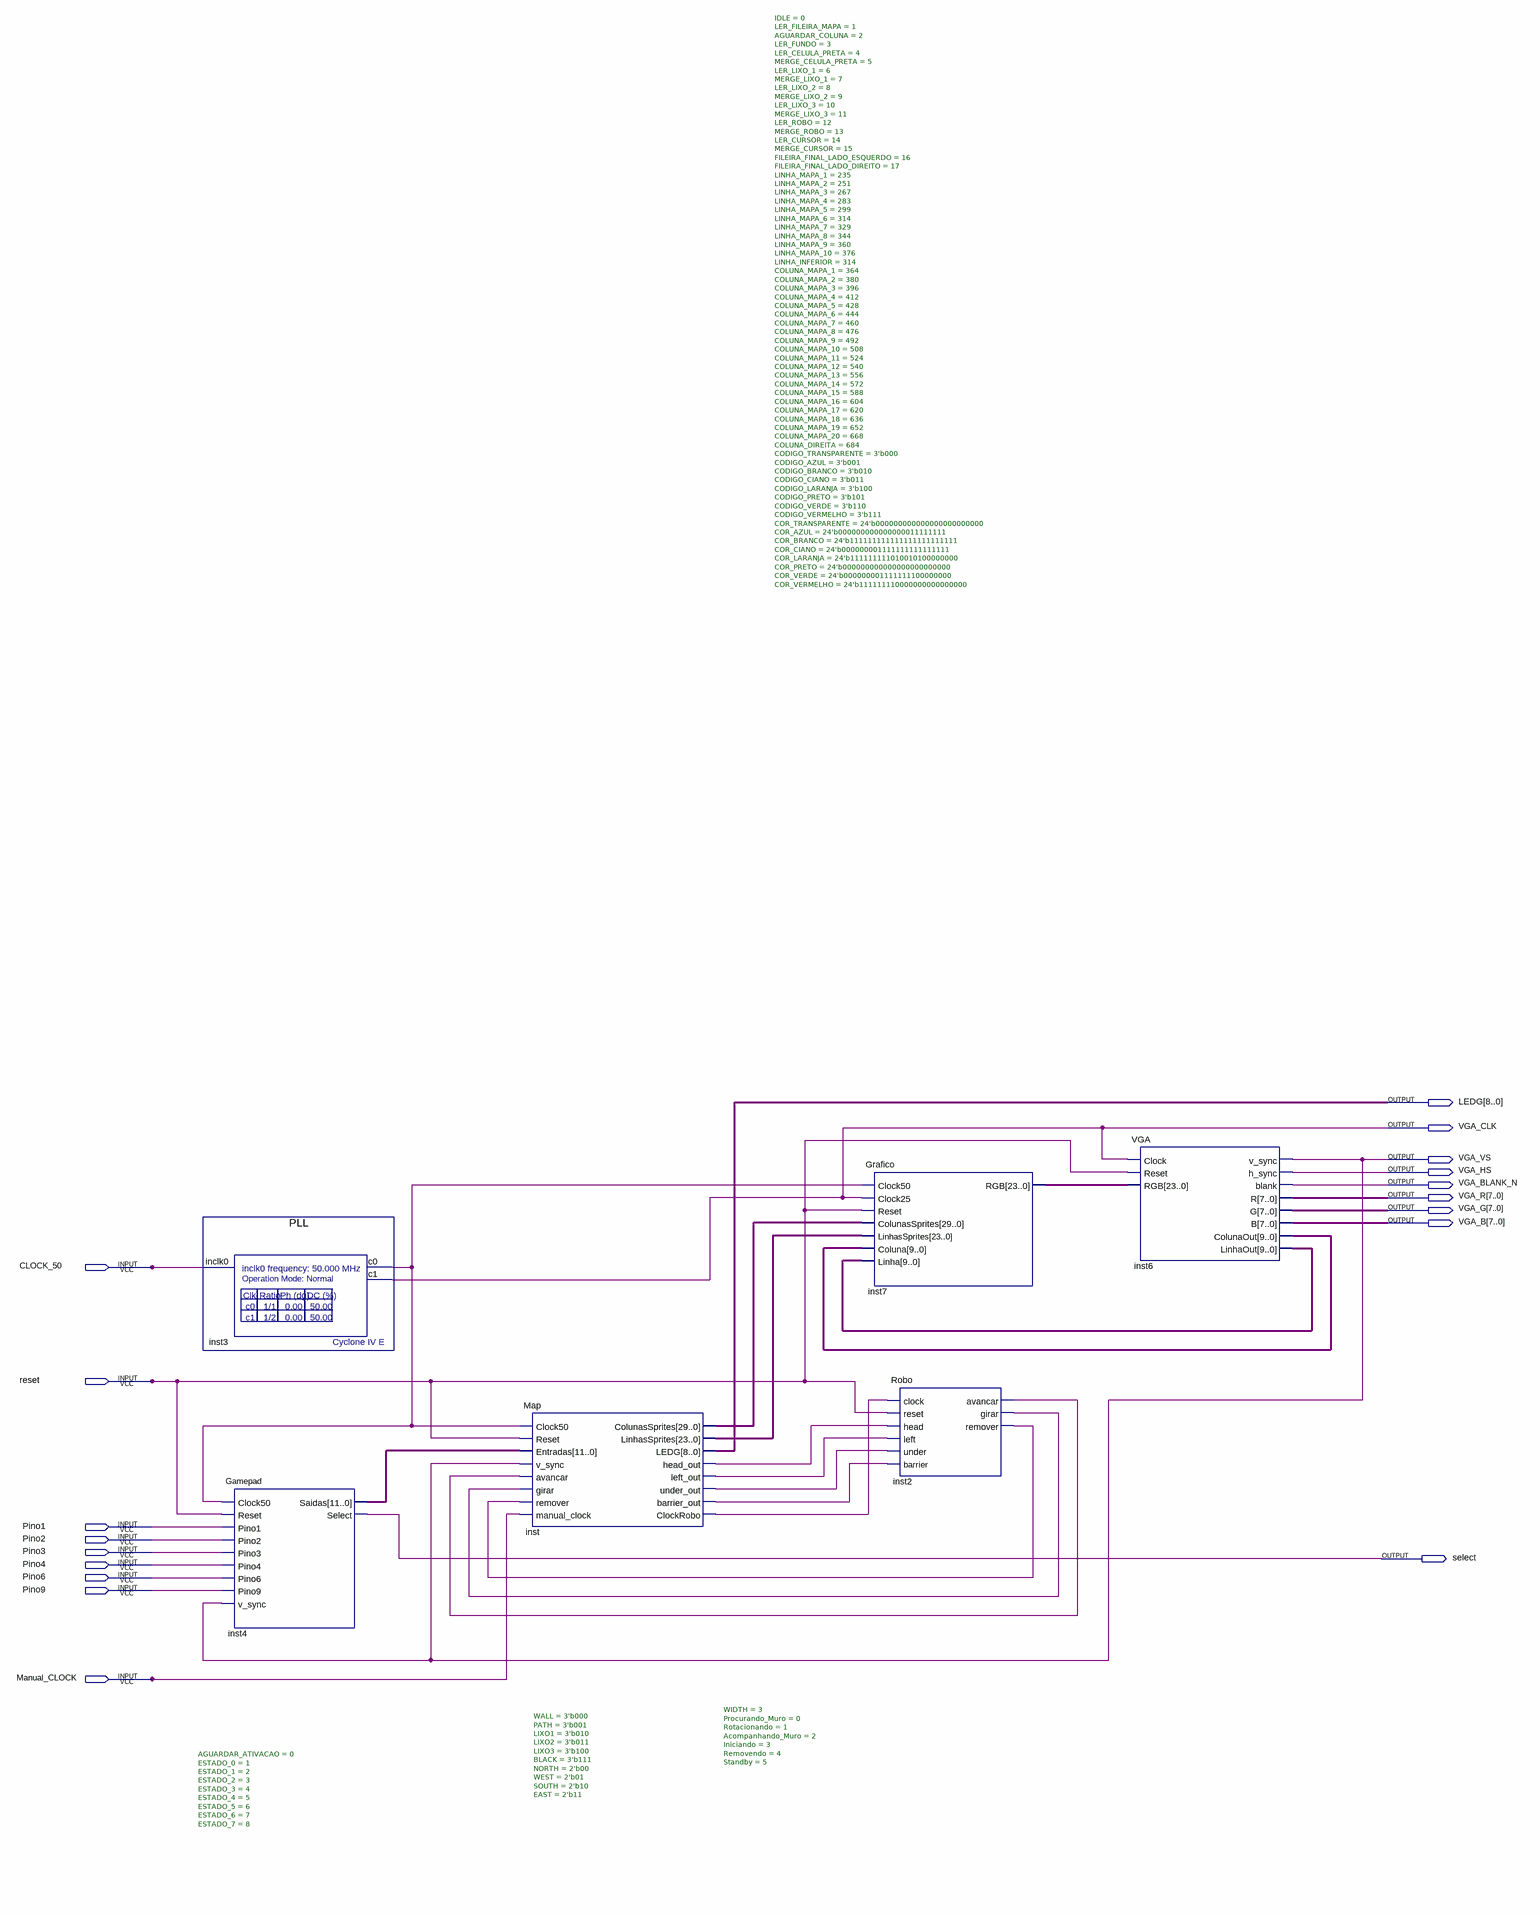
[diagram p0: schematic sheet]
// Quartus schematic interface_top.bdf as structural Verilog: 6 symbols, 18 pins
module interface_top (
  input  CLOCK_50,
  input  reset,
  input  Pino1,
  input  Pino2,
  input  Pino3,
  input  Pino4,
  input  Pino6,
  input  Pino9,
  input  Manual_CLOCK,
  output [8:0] LEDG,
  output VGA_CLK,
  output VGA_VS,
  output VGA_HS,
  output VGA_BLANK_N,
  output [7:0] VGA_R,
  output [7:0] VGA_G,
  output [7:0] VGA_B,
  output select
);

  wire inst2_avancar, inst2_girar, inst2_remover, inst3_c0, inst_barrier_out, inst_clockrobo, inst_head_out,
       inst_left_out, inst_under_out;
  wire [9:0] inst6_colunaout, inst6_linhaout;
  wire [11:0] inst4_saidas;
  wire [23:0] inst7_rgb, inst_linhassprites;
  wire [29:0] inst_colunassprites;

  PLL inst3 (.inclk0(CLOCK_50), .c0(inst3_c0), .c1(VGA_CLK));
  Gamepad #(.AGUARDAR_ATIVACAO(0), .ESTADO_0(1), .ESTADO_1(2), .ESTADO_2(3), .ESTADO_3(4), .ESTADO_4(5), .ESTADO_5(6), .ESTADO_6(7), .ESTADO_7(8)) inst4 (
    .Clock50(inst3_c0), .Reset(reset), .Pino1(Pino1), .Pino2(Pino2), .Pino3(Pino3), .Pino4(Pino4),
    .Pino6(Pino6), .Pino9(Pino9), .v_sync(VGA_VS), .Saidas(inst4_saidas), .Select(select));
  Map #(.WALL(3'b000), .PATH(3'b001), .LIXO1(3'b010), .LIXO2(3'b011), .LIXO3(3'b100), .BLACK(3'b111), .NORTH(2'b00), .WEST(2'b01), .SOUTH(2'b10), .EAST(2'b11)) inst (
    .Clock50(inst3_c0), .Reset(reset), .Entradas(inst4_saidas), .v_sync(VGA_VS), .avancar(inst2_avancar),
    .girar(inst2_girar), .remover(inst2_remover), .manual_clock(Manual_CLOCK),
    .ColunasSprites(inst_colunassprites), .LinhasSprites(inst_linhassprites), .LEDG(LEDG),
    .head_out(inst_head_out), .left_out(inst_left_out), .under_out(inst_under_out),
    .barrier_out(inst_barrier_out), .ClockRobo(inst_clockrobo));
  Grafico #(.IDLE(0), .LER_FILEIRA_MAPA(1), .AGUARDAR_COLUNA(2), .LER_FUNDO(3), .LER_CELULA_PRETA(4), .MERGE_CELULA_PRETA(5), .LER_LIXO_1(6), .MERGE_LIXO_1(7), .LER_LIXO_2(8), .MERGE_LIXO_2(9), .LER_LIXO_3(10), .MERGE_LIXO_3(11), .LER_ROBO(12), .MERGE_ROBO(13), .LER_CURSOR(14), .MERGE_CURSOR(15), .FILEIRA_FINAL_LADO_ESQUERDO(16), .FILEIRA_FINAL_LADO_DIREITO(17), .LINHA_MAPA_1(235), .LINHA_MAPA_2(251), .LINHA_MAPA_3(267), .LINHA_MAPA_4(283), .LINHA_MAPA_5(299), .LINHA_MAPA_6(314), .LINHA_MAPA_7(329), .LINHA_MAPA_8(344), .LINHA_MAPA_9(360), .LINHA_MAPA_10(376), .LINHA_INFERIOR(314), .COLUNA_MAPA_1(364), .COLUNA_MAPA_2(380), .COLUNA_MAPA_3(396), .COLUNA_MAPA_4(412), .COLUNA_MAPA_5(428), .COLUNA_MAPA_6(444), .COLUNA_MAPA_7(460), .COLUNA_MAPA_8(476), .COLUNA_MAPA_9(492), .COLUNA_MAPA_10(508), .COLUNA_MAPA_11(524), .COLUNA_MAPA_12(540), .COLUNA_MAPA_13(556), .COLUNA_MAPA_14(572), .COLUNA_MAPA_15(588), .COLUNA_MAPA_16(604), .COLUNA_MAPA_17(620), .COLUNA_MAPA_18(636), .COLUNA_MAPA_19(652), .COLUNA_MAPA_20(668), .COLUNA_DIREITA(684), .CODIGO_TRANSPARENTE(3'b000), .CODIGO_AZUL(3'b001), .CODIGO_BRANCO(3'b010), .CODIGO_CIANO(3'b011), .CODIGO_LARANJA(3'b100), .CODIGO_PRETO(3'b101), .CODIGO_VERDE(3'b110), .CODIGO_VERMELHO(3'b111), .COR_TRANSPARENTE(24'b000000000000000000000000), .COR_AZUL(24'b000000000000000011111111), .COR_BRANCO(24'b111111111111111111111111), .COR_CIANO(24'b000000001111111111111111), .COR_LARANJA(24'b111111111010010100000000), .COR_PRETO(24'b000000000000000000000000), .COR_VERDE(24'b000000001111111100000000), .COR_VERMELHO(24'b111111110000000000000000)) inst7 (
    .Clock50(inst3_c0), .Clock25(VGA_CLK), .Reset(reset), .ColunasSprites(inst_colunassprites),
    .LinhasSprites(inst_linhassprites), .Coluna(inst6_colunaout), .Linha(inst6_linhaout), .RGB(inst7_rgb));
  Robo #(.WIDTH(3), .Procurando_Muro(0), .Rotacionando(1), .Acompanhando_Muro(2), .Iniciando(3), .Removendo(4), .Standby(5)) inst2 (
    .clock(inst_clockrobo), .reset(reset), .head(inst_head_out), .left(inst_left_out),
    .under(inst_under_out), .barrier(inst_barrier_out), .avancar(inst2_avancar), .girar(inst2_girar),
    .remover(inst2_remover));
  VGA inst6 (
    .Clock(VGA_CLK), .Reset(reset), .RGB(inst7_rgb), .v_sync(VGA_VS), .h_sync(VGA_HS), .blank(VGA_BLANK_N),
    .R(VGA_R), .G(VGA_G), .B(VGA_B), .ColunaOut(inst6_colunaout), .LinhaOut(inst6_linhaout));
endmodule
